# EAGLE design SubHarmonics Control Board v1 (EAGLE 9.6.2)
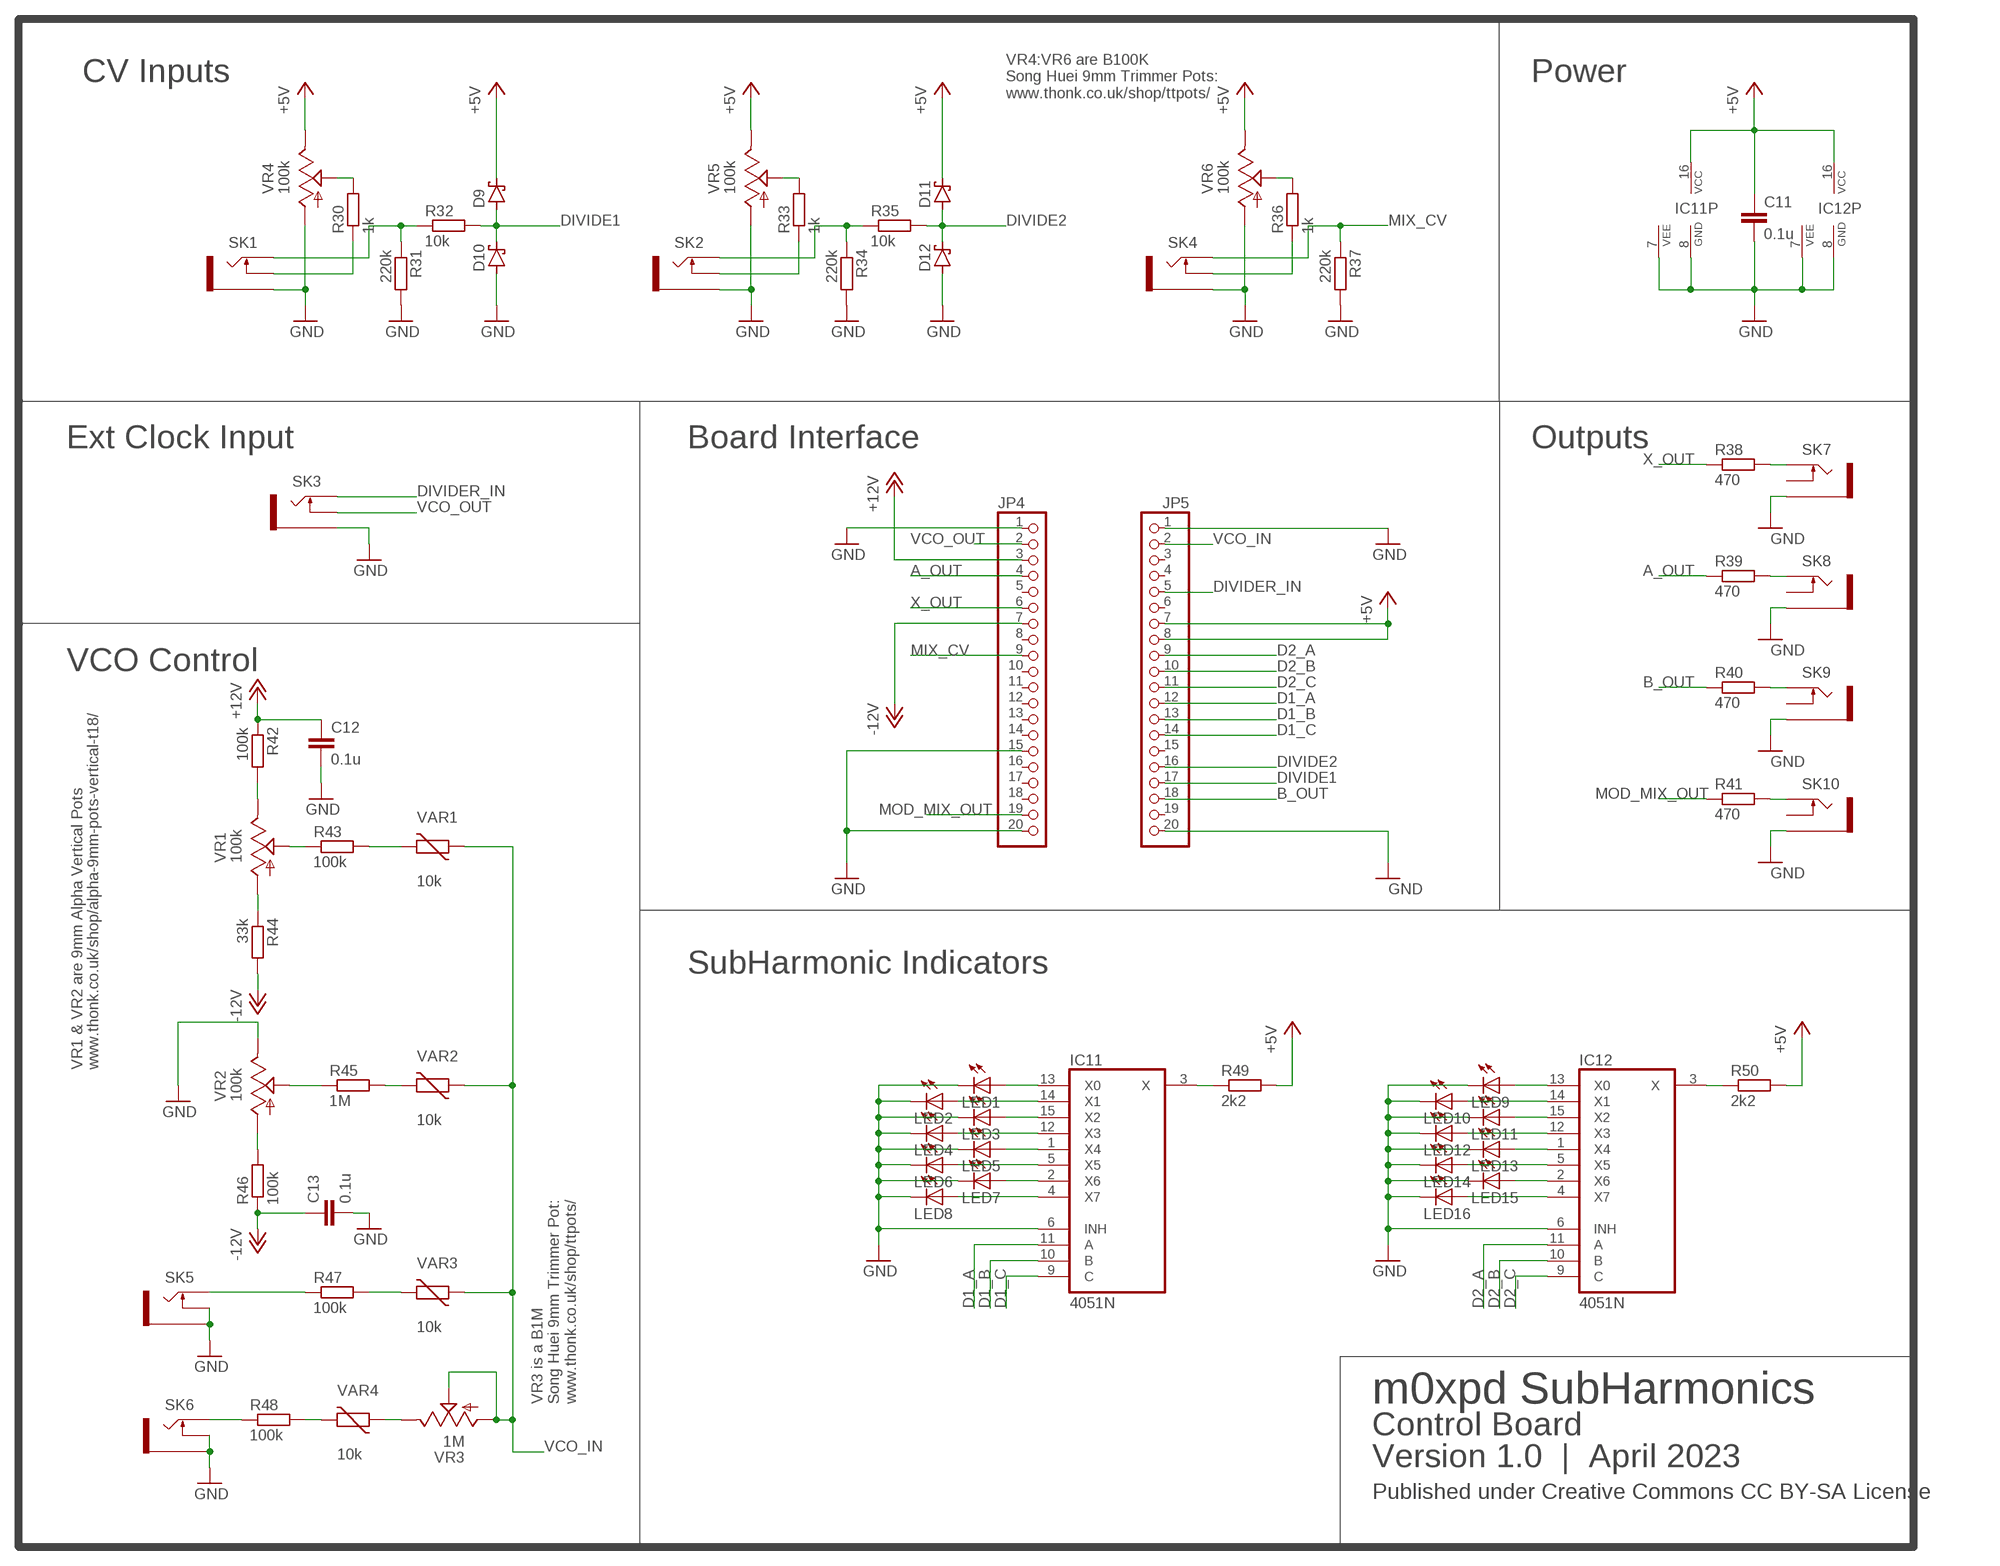
[diagram p0: schematic, sheet 1]

## Parts
C11  0.1u  C-EU050-025X075  [C050-025X075]
C12  0.1u  C-EU050-025X075  [C050-025X075]
C13  0.1u  C-EU050-025X075  [C050-025X075]
D9  1N5817-T  [DO41-7.6]
D10  1N5817-T  [DO41-7.6]
D11  1N5817-T  [DO41-7.6]
D12  1N5817-T  [DO41-7.6]
IC11  4051N  [DIL16]
IC12  4051N  [DIL16]
JP4  PINHD-1X20  [1X20]
JP5  PINHD-1X20  [1X20]
LED1  LED3MM  [LED3MM]
LED2  LED3MM  [LED3MM]
LED3  LED3MM  [LED3MM]
LED4  LED3MM  [LED3MM]
LED5  LED3MM  [LED3MM]
LED6  LED3MM  [LED3MM]
LED7  LED3MM  [LED3MM]
LED8  LED3MM  [LED3MM]
LED9  LED3MM  [LED3MM]
LED10  LED3MM  [LED3MM]
LED11  LED3MM  [LED3MM]
LED12  LED3MM  [LED3MM]
LED13  LED3MM  [LED3MM]
LED14  LED3MM  [LED3MM]
LED15  LED3MM  [LED3MM]
LED16  LED3MM  [LED3MM]
R30  1k  R-EU_0204/7  [0204/7]
R31  220k  R-EU_0204/7  [0204/7]
R32  10k  R-EU_0204/7  [0204/7]
R33  1k  R-EU_0204/7  [0204/7]
R34  220k  R-EU_0204/7  [0204/7]
R35  10k  R-EU_0204/7  [0204/7]
R36  1k  R-EU_0204/7  [0204/7]
R37  220k  R-EU_0204/7  [0204/7]
R38  470  R-EU_0204/7  [0204/7]
R39  470  R-EU_0204/7  [0204/7]
R40  470  R-EU_0204/7  [0204/7]
R41  470  R-EU_0204/7  [0204/7]
R42  100k  R-EU_0204/7  [0204/7]
R43  100k  R-EU_0204/7  [0204/7]
R44  33k  R-EU_0204/7  [0204/7]
R45  1M  R-EU_0204/7  [0204/7]
R46  100k  R-EU_0204/7  [0204/7]
R47  100k  R-EU_0204/7  [0204/7]
R48  100k  R-EU_0204/7  [0204/7]
R49  2k2  R-EU_0204/7  [0204/7]
R50  2k2  R-EU_0204/7  [0204/7]
SK1  THONKICONN_JACK  [WQP-PJ301M-12_JACK]
SK2  THONKICONN_JACK  [WQP-PJ301M-12_JACK]
SK3  THONKICONN_JACK  [WQP-PJ301M-12_JACK]
SK4  THONKICONN_JACK  [WQP-PJ301M-12_JACK]
SK5  THONKICONN_JACK  [WQP-PJ301M-12_JACK]
SK6  THONKICONN_JACK  [WQP-PJ301M-12_JACK]
SK7  THONKICONN_JACK  [WQP-PJ301M-12_JACK]
SK8  THONKICONN_JACK  [WQP-PJ301M-12_JACK]
SK9  THONKICONN_JACK  [WQP-PJ301M-12_JACK]
SK10  THONKICONN_JACK  [WQP-PJ301M-12_JACK]
VAR1  10k  VARISTOR  [C025-024X044]
VAR2  10k  VARISTOR  [C025-024X044]
VAR3  10k  VARISTOR  [C025-024X044]
VAR4  10k  VARISTOR  [C025-024X044]
VR1  100k  9MM_SNAP-IN_POT_  [9MM_SNAP-IN_POT]
VR2  100k  9MM_SNAP-IN_POT_  [9MM_SNAP-IN_POT]
VR3  1M  9MM_SNAP-IN_POT_  [9MM_SNAP-IN_POT]
VR4  100k  9MM_SNAP-IN_POT_  [9MM_SNAP-IN_POT]
VR5  100k  9MM_SNAP-IN_POT_  [9MM_SNAP-IN_POT]
VR6  100k  9MM_SNAP-IN_POT_  [9MM_SNAP-IN_POT]

## Nets
+5V: C11.1 D9.C D11.C IC11.16(VCC) IC12.16(VCC) JP5.7 JP5.8 R49.2 R50.2 VR4.3(E) VR5.3(E) VR6.3(E)
+12V: C12.1 JP4.3 R42.1
-12V: C13.1 JP4.7 R44.2 R46.1
A_OUT: JP4.4 R39.1
B_OUT: JP5.18 R40.1
D1_A: IC11.11(A) JP5.12
D1_B: IC11.10(B) JP5.13
D1_C: IC11.9(C) JP5.14
D2_A: IC12.11(A) JP5.9
D2_B: IC12.10(B) JP5.10
D2_C: IC12.9(C) JP5.11
DIVIDE1: D9.A D10.C JP5.17 R32.2
DIVIDE2: D11.A D12.C JP5.16 R35.2
DIVIDER_IN: JP5.5 SK3.P$1_TIP(TIP)
GND: C11.2 C12.2 C13.2 D10.A D12.A IC11.6(INH) IC11.7(VEE) IC11.8(GND) IC12.6(INH) IC12.7(VEE) IC12.8(GND) JP4.1 JP4.15 JP4.20 JP5.1 JP5.20 LED1.K(C) LED2.K(C) LED3.K(C) LED4.K(C) LED5.K(C) LED6.K(C) LED7.K(C) LED8.K(C) LED9.K(C) LED10.K(C) LED11.K(C) LED12.K(C) LED13.K(C) LED14.K(C) LED15.K(C) LED16.K(C) R31.2 R34.2 R37.2 SK1.P$3_SLEEVE(SLEEVE) SK2.P$3_SLEEVE(SLEEVE) SK3.P$3_SLEEVE(SLEEVE) SK4.P$3_SLEEVE(SLEEVE) SK5.P$2_SWITCH(SWITCH) SK5.P$3_SLEEVE(SLEEVE) SK6.P$2_SWITCH(SWITCH) SK6.P$3_SLEEVE(SLEEVE) SK7.P$3_SLEEVE(SLEEVE) SK8.P$3_SLEEVE(SLEEVE) SK9.P$3_SLEEVE(SLEEVE) SK10.P$3_SLEEVE(SLEEVE) VR2.3(E) VR4.1(A) VR5.1(A) VR6.1(A)
MIX_CV: JP4.9 R37.1 SK4.P$1_TIP(TIP)
MOD_MIX_OUT: JP4.19 R41.1
N$2: R38.2 SK7.P$1_TIP(TIP)
N$4: R39.2 SK8.P$1_TIP(TIP)
N$6: R40.2 SK9.P$1_TIP(TIP)
N$8: R41.2 SK10.P$1_TIP(TIP)
N$30: R30.1 SK1.P$2_SWITCH(SWITCH)
N$33: R31.1 R32.1 SK1.P$1_TIP(TIP)
N$34: R42.2 VR1.3(E)
N$35: R44.1 VR1.1(A)
N$36: R43.1 VR1.2(S)
N$38: R43.2 VAR1.2
N$39: R47.2 VAR3.2
N$40: R47.1 SK5.P$1_TIP(TIP)
N$41: R46.2 VR2.1(A)
N$42: R45.1 VR2.2(S)
N$43: R45.2 VAR2.2
N$44: R48.1 SK6.P$1_TIP(TIP)
N$45: R48.2 VAR4.2
N$46: VAR4.1 VR3.3(E)
N$56: R30.2 VR4.2(S)
N$57: R33.1 SK2.P$2_SWITCH(SWITCH)
N$58: R34.1 R35.1 SK2.P$1_TIP(TIP)
N$59: IC11.13(X0) LED1.A
N$60: IC11.14(X1) LED2.A
N$61: IC11.15(X2) LED3.A
N$62: IC11.12(X3) LED4.A
N$63: IC11.1(X4) LED5.A
N$64: IC11.5(X5) LED6.A
N$65: IC11.2(X6) LED7.A
N$66: IC11.4(X7) LED8.A
N$67: IC12.13(X0) LED9.A
N$71: IC11.3(X) R49.1
N$72: IC12.14(X1) LED10.A
N$73: IC12.15(X2) LED11.A
N$74: IC12.12(X3) LED12.A
N$75: IC12.1(X4) LED13.A
N$76: IC12.5(X5) LED14.A
N$77: IC12.2(X6) LED15.A
N$78: IC12.4(X7) LED16.A
N$81: R33.2 VR5.2(S)
N$82: IC12.3(X) R50.1
N$92: R36.1 SK4.P$2_SWITCH(SWITCH)
N$94: R36.2 VR6.2(S)
VCO_IN: JP5.2 VAR1.1 VAR2.1 VAR3.1 VR3.1(A) VR3.2(S)
VCO_OUT: JP4.2 SK3.P$2_SWITCH(SWITCH)
X_OUT: JP4.6 R38.1
Unconnected: JP4.5 JP4.8 JP4.10 JP4.11 JP4.12 JP4.13 JP4.14 JP4.16 JP4.17 JP4.18 JP5.3 JP5.4 JP5.6 JP5.15 JP5.19 SK7.P$2_SWITCH(SWITCH) SK8.P$2_SWITCH(SWITCH) SK9.P$2_SWITCH(SWITCH) SK10.P$2_SWITCH(SWITCH)

## Notes on the sheet
- CV Inputs | Power
- VR4:VR6 are B100K 
  Song Huei 9mm Trimmer Pots:
  www.thonk.co.uk/shop/ttpots/
- Ext Clock Input | Board Interface | Outputs
- VCO Control
- SubHarmonic Indicators
- VR1 & VR2 are 9mm Alpha Vertical Pots | www.thonk.co.uk/shop/alpha-9mm-pots-vertical-t18/
- VR3 is a B1M 
  Song Huei 9mm Trimmer Pot:
  www.thonk.co.uk/shop/ttpots/
- m0xpd SubHarmonics
- Control Board
- Version 1.0  |  April 2023
- Published under Creative Commons CC BY-SA License

## Library data of the parts
C11-C13 = rcl:C-EU: CAPACITOR, European symbol; SPICEPREFIX: C
D9-D12 = diode:1N581*: 1.0A SCHOTTKY BARRIER RECTIFIER Source: http://www.diodes.com/datasheets/ds23001.pdf
IC11 IC12 = 40xx:4051: 8-channel ANALOG MULTIPLEXER
JP4 JP5 = pinhead:PINHD-1X20: PIN HEADER
LED1-LED16 = adafruit:LED: LED OSRAM: - CHIPLED LG R971, LG N971, LY N971, LG Q971, LY Q971, LO R971, LY R971 LH N974, LH R974 LS Q976, LO Q976, LY Q976 LO Q996 - Hyper CHIPLED LW Q18S LB Q993, LB Q99A, LB R99A - SideLED LS A670, LO A670, LY A670, LG A670, LP A670 LB A673, LV A673, LT A673, LW A673 LH A674 LY A675 LS A676, LA A676, LO A676, LY A676, LW A676 LS A679, LY A679, LG A679 - Hyper Micro SIDELED® LS Y876, LA Y876, LO Y876, LY Y876 LT Y87S - SmartLED LW L88C, LW L88S LB L89C, LB L89S, LG L890 LS L89K, LO L89K, LY L89K LS L896, LA L896, LO L896, LY L896 - TOPLED LS T670, LO T670, LY T670, LG T670, LP T670 LSG T670, LSP T670, LSY T670, LOP T670, LYG T670 LG T671, LOG T671, LSG T671 LB T673, LV T673, LT T673, LW T673 LH T674 LS T676, LA T676, LO T676, LY T676, LB T676, LH T676, LSB T676, LW T676 LB T67C, LV T67C, LT T67C, LS T67K, LO T67K, LY T67K, LW E67C LS E67B, LA E67B, LO E67B, LY E67B, LB E67C, LV E67C, LT E67C LW T67C LS T679, LY T679, LG T679 LS T770, LO T770, LY T770, LG T770, LP T770 LB T773, LV T773, LT T773, LW T773 LH T774 LS E675, LA E675, LY E675, LS T675 LS T776, LA T776, LO T776, LY T776, LB T776 LHGB T686 LT T68C, LB T68C - Hyper Mini TOPLED® LB M676 - Mini TOPLED Santana® LG M470 LS M47K, LO M47K, LY M47K Source: http://www.osram.convergy.de/
R30-R50 = rcl:R-EU_: RESISTOR, European symbol; SPICEPREFIX: R
SK1-SK10 = MyLibrary:THONKICONN_JACK
VAR1-VAR4 = MyLibrary:VARISTOR: NTC Varistor
VR1-VR6 = MusicThingModular:9MM_SNAP-IN_POT: 9mm vertical snap-in pot, Alpha / Panasonic style

## Board
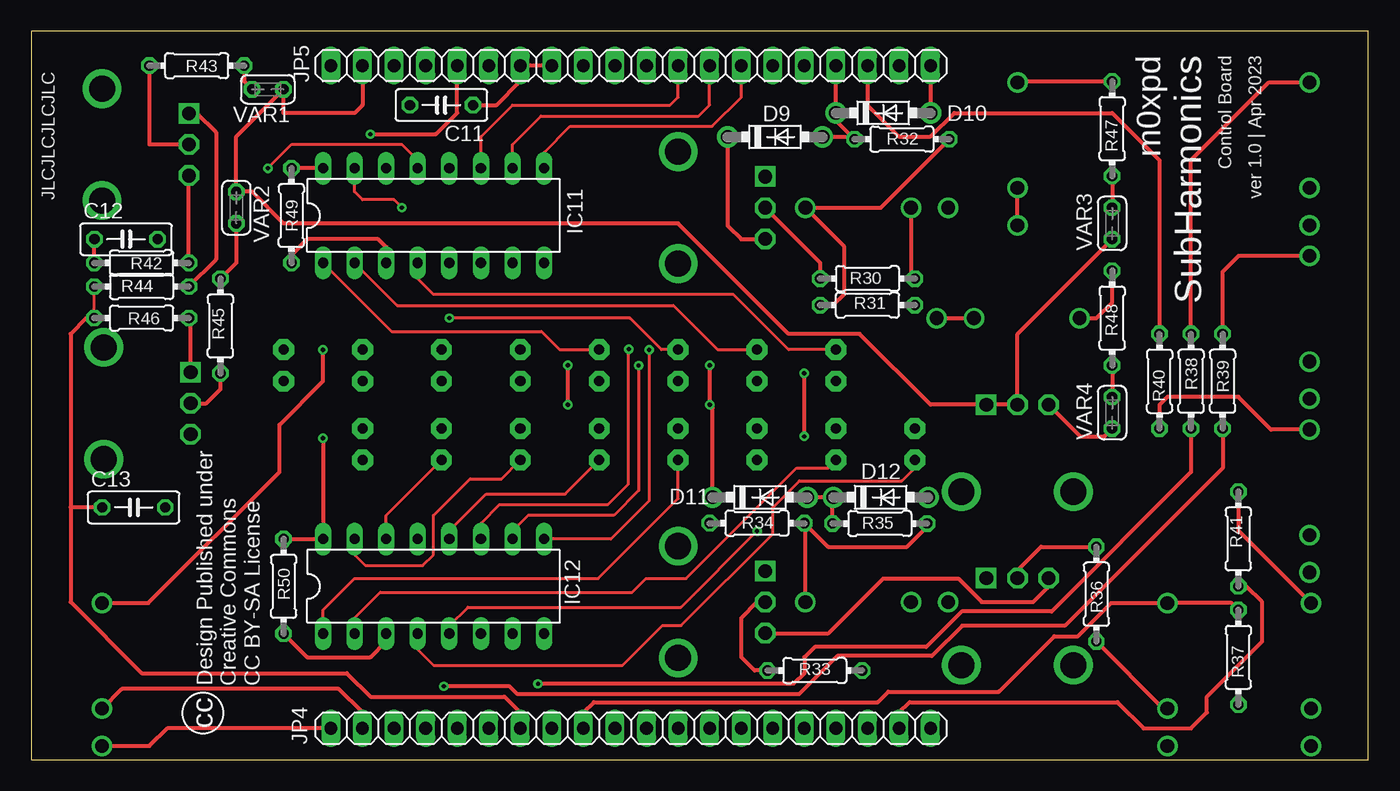
[diagram p1: board, top side]
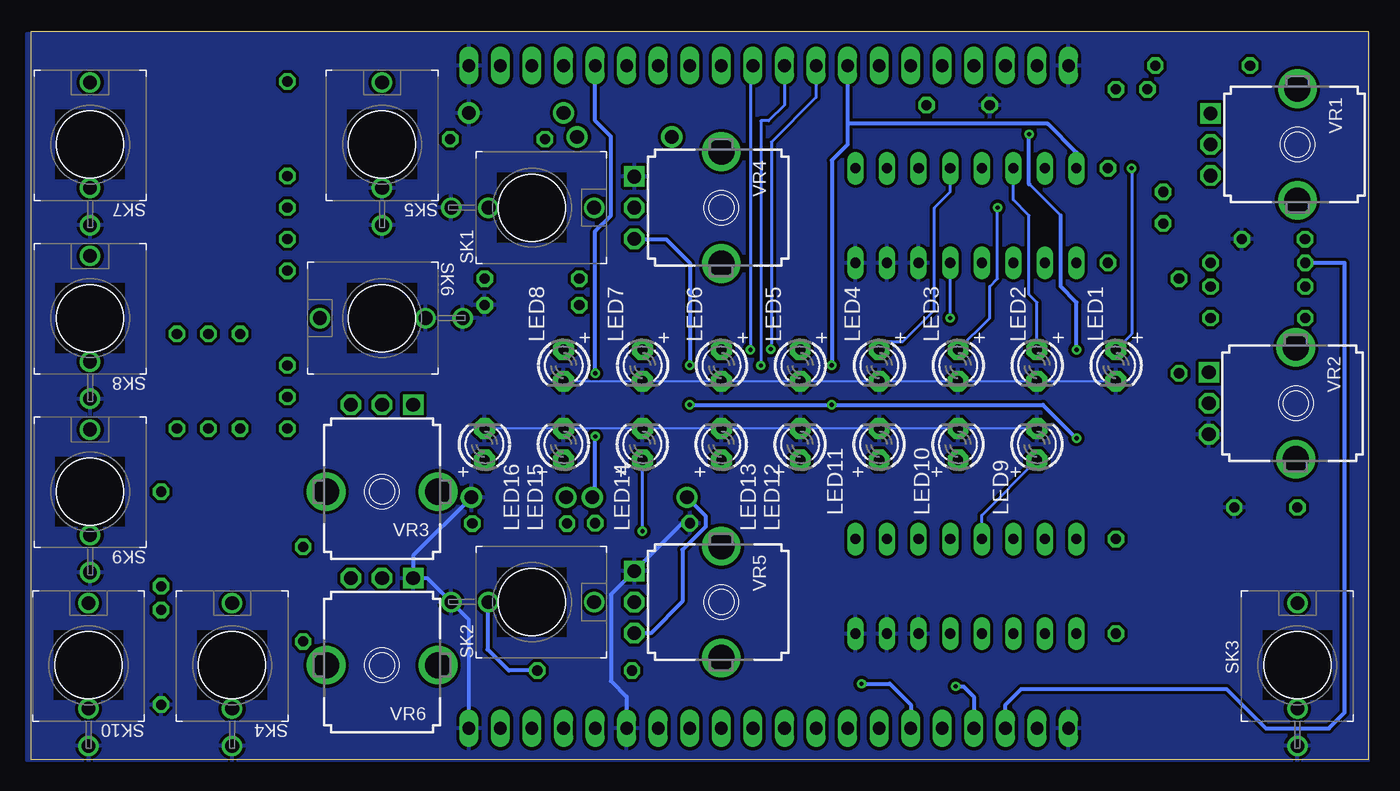
[diagram p2: board, bottom side, seen from below]

Size 107.62 x 58.66 mm. Coordinates in mm from the lower left corner, seen from the top.
Outline: 0,0 107.62,0 107.62,58.66 0,58.66 0,0
Copper layers (1*16): Top 0.035mm / dielectric 1.5mm / Bottom 0.035mm
Design rules "default *": minimum track width 6mil, minimum drill 0.35mm, track to track 10mil, track to pad 10mil, pad to pad 6mil, via to via 6mil, smd to smd 6mil, copper to edge 0mil, drill to drill 6mil, minimum pad ring 10mil, minimum via ring 8mil, stop-mask expansion 4mil, vias tented up to drill 0mil, thermal gap 10mil

### Footprints (pad centres in the part's own frame; a part is rotated, then mirrored left to right if it is on the bottom)
C050-025X075 = drill 0.813 octagon: 1 -2.54,0; 2 2.54,0
DO41-7.6 = drill 1.1 pad 1.7: A 3.81,0; C -3.81,0
DIL16 = drill 0.813 long: 1 -8.89,-3.81; 2 -6.35,-3.81; 3 -3.81,-3.81; 4 -1.27,-3.81; 5 1.27,-3.81; 6 3.81,-3.81; 7 6.35,-3.81; 8 8.89,-3.81; 9 8.89,3.81; 10 6.35,3.81; 11 3.81,3.81; 12 1.27,3.81; 13 -1.27,3.81; 14 -3.81,3.81; 15 -6.35,3.81; 16 -8.89,3.81
1X20 = drill 1.016 long: 1 -24.13,0; 2 -21.59,0; 3 -19.05,0; 4 -16.51,0; 5 -13.97,0; 6 -11.43,0; 7 -8.89,0; 8 -6.35,0; 9 -3.81,0; 10 -1.27,0; 11 1.27,0; 12 3.81,0; 13 6.35,0; 14 8.89,0; 15 11.43,0; 16 13.97,0; 17 16.51,0; 18 19.05,0; 19 21.59,0; 20 24.13,0
LED3MM = drill 0.813 pad 1.676 octagon: A -1.27,0; K 1.27,0
0204/7 = drill 0.813 octagon: 1 -3.81,0; 2 3.81,0
WQP-PJ301M-12_JACK = drill 1.1: P$1_TIP 0,5; P$2_SWITCH 0,-3.5; P$3_SLEEVE 0,-6.5
C025-024X044 = drill 0.813 octagon: 1 -1.27,0; 2 1.27,0
9MM_SNAP-IN_POT = drill 1.1 square: 1 -2.5,-7 | drill 1.1 octagon: 2 0,-7; 3 2.5,-7 | drill 2.1 pad 2.794: CHASSIS1 -4.5,0; CHASSIS2 4.5,0

### Placement (x,y rotation side)
C11  33.02,52.7 180 top
C12  7.65,41.91 0 top
C13  8.26,20.32 0 top
D9  59.87,50.14 0 top
D10  68.58,52.07 0 top
D11  58.65,21.13 0 top
D12  68.38,21.13 0 top
IC11  32.38,43.81 0 top
IC12  32.38,13.97 0 top
JP4  48.26,2.54 0 top
JP5  48.26,55.88 0 top
LED1  20.32,31.75 270 bottom
LED2  26.67,31.75 270 bottom
LED3  33.02,31.75 270 bottom
LED4  39.37,31.75 270 bottom
LED5  45.72,31.75 270 bottom
LED6  52.07,31.75 270 bottom
LED7  58.42,31.75 270 bottom
LED8  64.77,31.75 270 bottom
LED9  26.67,25.4 90 bottom
LED10  33.02,25.4 90 bottom
LED11  39.37,25.4 90 bottom
LED12  45.72,25.4 90 bottom
LED13  52.07,25.4 90 bottom
LED14  58.42,25.4 90 bottom
LED15  64.77,25.4 90 bottom
LED16  71.12,25.4 90 bottom
R30  67.31,38.73 180 top
R31  67.31,36.6 0 top
R32  70.08,49.96 180 top
R33  63.07,7.19 180 top
R34  58.42,19.05 180 top
R35  68.3,19.02 180 top
R36  85.72,13.34 90 top
R37  97.16,8.26 270 top
R38  93.34,30.48 90 top
R39  95.89,30.48 90 top
R40  90.81,30.48 270 top
R41  97.16,17.78 90 top
R42  8.89,40.01 0 top
R43  13.34,55.88 0 top
R44  8.89,38.1 180 top
R45  15.24,34.92 90 top
R46  8.89,35.56 0 top
R47  87,50.8 270 top
R48  87,35.56 270 top
R49  20.95,43.81 90 top
R50  20.32,13.97 90 top
SK1  67.31,44.45 270 bottom
SK2  67.31,12.7 270 bottom
SK3  5.71,7.62 0 bottom
SK4  91.44,7.62 0 bottom
SK5  79.38,49.53 0 bottom
SK6  79.38,35.56 90 bottom
SK7  102.87,49.53 0 bottom
SK8  102.87,35.56 0 bottom
SK9  102.87,21.59 0 bottom
SK10  103,7.62 0 bottom
VAR1  19.05,53.98 180 top
VAR2  16.51,44.45 270 top
VAR3  87,43.18 90 top
VAR4  87,27.94 90 top
VR1  5.71,49.53 270 bottom
VR2  5.84,28.7 270 bottom
VR3  79.38,21.59 180 bottom
VR4  52.07,44.45 270 bottom
VR5  52.07,12.7 270 bottom
VR6  79.38,7.62 180 bottom

### Tracks (layer width: path | path; a pad name or v marks a point on that pad's centre or on a via)
+5V  (via drill 0.35)
  Top 0.305: v43.18,31.75 v43.18,28.57 | v23.5,25.88 IC12.16 R50.2 | IC11.16 R49.2 | JP5.8 JP5.7 39.37,54.61 37.47,52.7 C11.1 | VR5.3 64.17,10.2 68.58,14.61 74.61,14.61 76.51,12.7 80.64,12.7 81.88,13.93 VR6.3 | D11.C 54.84,28.35 v54.61,28.57 v54.61,31.75 | D9.C 56.06,43 57.15,41.91 59.03,41.91 VR4.3
  Bottom 0.305: v43.18,31.75 43.18,48.26 41.91,49.53 41.91,51.21 | JP5.8 41.91,51.21 | v23.5,25.88 26.19,28.57 v43.18,28.57 v54.61,28.57 | IC11.16 23.5,48.9 25.81,51.21 41.91,51.21 | D11.C 53.34,19.63 53.34,18.77 55.2,16.91 55.2,12.74 57.74,10.2 VR5.3 | VR4.3 59.03,41.91 56.52,41.91 54.61,40.01 v54.61,31.75
+12V
  Top 0.152: 5.08,41.88 C12.1
  Top 0.305: R42.1 5.08,41.88
  Bottom 0.305: JP4.3 29.21,4.45 27.94,5.71 11.43,5.71 8.26,2.54 3.17,2.54 1.91,3.81 1.91,40.01 R42.1
-12V
  Top 0.254: R46.1 R44.2
  Top 0.305: R46.1 4.45,35.56 3.17,34.29 3.17,20.32 | 3.17,20.32 3.17,12.7 8.89,6.99 25.4,6.99 27.3,5.08 38.1,5.08 39.37,3.81 JP4.7 | C13.1 3.17,20.32
A_OUT  (via drill 0.35)
  Top 0.305: R39.1 95.89,23.5 83.19,10.79 74.93,10.79 72.49,8.36 64.87,8.36 61.8,5.28 39.15,5.28 38.52,5.92 v33.22,5.92
  Bottom 0.305: v33.22,5.92 32.59,5.92 31.75,5.08 JP4.4
B_OUT
  Top 0.305: R40.1 90.81,48.26 87,52.07 74.3,52.07 72.39,50.16 69.85,50.16 67.31,52.7 JP5.18
D1_A
  Top 0.254: IC11.11 36.2,50.16 38.73,52.7 51.44,52.7 52.07,53.34 JP5.12
D1_B
  Top 0.254: IC11.10 38.73,49.53 41.02,51.82 53.72,51.82 54.61,52.7 JP5.13
D1_C
  Top 0.254: IC11.9 41.27,48.9 43.38,51 54.81,51 57.15,53.34 JP5.14
D2_A  (via drill 0.35)
  Top 0.152: v48.09,33.06 48.09,32.81 48.06,32.79
  Top 0.254: 48.06,32.79 48.06,22.17 46.41,20.52 37.67,20.52 36.2,19.05 IC12.11
  Bottom 0.152: v48.09,33.06 48.09,33.42 48.06,33.45
  Bottom 0.254: JP5.9 44.45,53.34 48.06,49.73 48.06,33.45
D2_B  (via drill 0.35)
  Top 0.152: 48.89,25.41 48.9,25.4 | 48.9,24.98 48.89,24.98
  Top 0.254: v48.89,31.74 48.89,25.41 | 48.9,25.4 48.9,24.98 | 48.89,24.98 48.89,21.67 46.9,19.68 40.01,19.68 38.73,18.41 IC12.10
  Bottom 0.152: v48.9,31.75 v48.89,31.74
  Bottom 0.254: JP5.10 46.99,52.7 48.26,51.44 48.9,51.44 v48.9,31.75
D2_C  (via drill 0.35)
  Top 0.254: v49.73,33.02 49.73,20.85 46.66,17.78 IC12.9
  Bottom 0.152: JP5.11 49.73,55.68
  Bottom 0.254: 49.73,55.68 v49.73,33.02
DIVIDE1
  Top 0.305: D9.A 66.09,50.14 R32.2 64.77,51.46 D10.C JP5.17
DIVIDE2  (via drill 0.35)
  Top 0.305: R35.2 64.49,21.06 D12.C D11.A | v62.23,26.04 v62.23,31.11
  Bottom 0.305: D11.A 62.23,21.36 v62.23,26.04 | v62.23,31.11 62.23,42.55 60.96,43.81 60.96,50.16 62.23,51.44 JP5.16
DIVIDER_IN  (via drill 0.35)
  Top 0.305: v23.5,33.02 23.5,30.48 19.99,26.98 19.99,23.16 9.45,12.62 SK3.P$1_TIP | v27.3,50.37 32.59,50.37 34.29,52.07 JP5.5
  Bottom 0.254: 24.77,43.81 27.28,46.33
  Bottom 0.305: v23.5,33.02 23.5,36.83 24.77,38.1 24.77,43.81 | 27.28,46.33 27.3,46.33 v27.3,50.37
GND
  Top 0.305: SK5.P$3_SLEEVE SK5.P$2_SWITCH | SK6.P$3_SLEEVE SK6.P$2_SWITCH | JP4.1 10.95,2.54 9.53,1.12 SK3.P$3_SLEEVE | JP5.20 D10.A
  Bottom 0.152: LED8.K LED7.K LED6.K LED5.K LED4.K LED3.K LED2.K LED1.K | LED9.K LED10.K LED11.K LED12.K | 46.35,26.67 LED12.K | LED12.K LED13.K LED14.K LED15.K LED16.K
  Bottom 0.305: R34.2 55.22,19.05 VR5.1 60.96,13.31 60.96,6.35 59.69,5.08 JP4.15 | JP4.20 72.39,11.28 SK2.P$3_SLEEVE 75.73,14.62 VR6.1 76.88,16.45 D12.A
  pour Bottom: 0,0 0,58.42 107.95,58.42 107.95,0
MIX_CV
  Top 0.305: R37.1 96.6,12.62 SK4.P$1_TIP 86.92,12.62 84.25,9.96 82.35,9.96 77.88,5.49 68.99,5.49 68.15,4.65 45.29,4.65 44.45,3.81 JP4.9
MOD_MIX_OUT
  Top 0.305: JP4.19 69.85,3.81 70.69,4.65 87.43,4.65 89.53,2.54 93.34,2.54 94.61,3.81 94.61,5.08 99.06,9.53 99.06,12.7 97.79,13.97 R41.1
N$2
  Top 0.305: R38.2 93.34,48.26 99.61,54.53 SK7.P$1_TIP
N$4
  Top 0.305: SK8.P$1_TIP 97.16,40.56 95.89,39.29 R39.2
N$6
  Top 0.305: SK9.P$1_TIP 99.78,26.59 97.16,29.21 91.44,29.21 90.81,28.57 R40.2
N$8
  Top 0.305: SK10.P$1_TIP 97.16,18.46 R41.2
N$30
  Top 0.305: SK1.P$2_SWITCH 70.81,39.05 R30.1
N$33
  Top 0.305: R31.1 64.54,36.6 65.41,37.47 65.41,41.35 SK1.P$1_TIP 68.38,44.45 R32.1
N$34
  Top 0.305: R42.2 12.7,47.02 VR1.3
N$35
  Top 0.305: R44.1 14.88,40.28 14.88,50.52 13.38,52.03 VR1.1
N$36
  Top 0.305: VR1.2 9.53,49.53 R43.1
N$38
  Top 0.305: R43.2 17.14,54.61 VAR1.2
N$39
  Top 0.305: R47.2 VAR3.2
N$40
  Top 0.305: SK5.P$1_TIP 79.45,54.61 R47.1
N$41
  Top 0.305: VR2.1 12.84,35.42 R46.2
N$42
  Top 0.305: VR2.2 14.1,28.7 15.24,29.84 R45.1
N$43
  Top 0.305: R45.2 16.51,40.01 VAR2.2
N$44
  Top 0.305: SK6.P$1_TIP 85.72,35.56 87,36.83 R48.1
N$45
  Top 0.305: R48.2 VAR4.2
N$46
  Top 0.305: VR3.3 84.43,26.04 86.36,26.04 VAR4.1
N$56
  Top 0.305: VR4.2 63.5,40.02 R30.2
N$57
  Bottom 0.305: R33.1 69.19,7.19 70.89,8.89 70.89,12.62 SK2.P$2_SWITCH
N$58
  Top 0.305: SK2.P$1_TIP 62.31,18.97 R34.1 64.14,17.14 70.48,17.14 72.11,18.77 R35.1
N$59  (via drill 0.35)
  Top 0.152: 31.09,47.65 IC11.13
  Top 0.254: 31.09,47.65 31.09,48.28 29.82,49.55 20.98,49.55 v19.05,47.62
  Bottom 0.254: LED1.A 19.05,34.29 v19.05,47.62
N$60
  Bottom 0.254: LED2.A 26.67,36.83 27.3,37.47 27.3,43.81 28.57,45.09 IC11.14
N$61  (via drill 0.35)
  Top 0.254: v29.84,44.45 29.21,45.09 26.67,45.09 26.04,45.72 IC11.15
  Bottom 0.254: LED3.A 30.48,35.56 30.48,38.1 29.84,38.73 v29.84,44.45
N$62
  Bottom 0.152: LED4.A 38.73,33.66
  Bottom 0.254: 38.73,33.66 37.47,33.66 34.92,36.2 34.92,44.45 33.66,45.72 IC11.12
N$63
  Top 0.254: IC11.1 29.01,34.49 41.07,34.49 42.55,33.02 LED5.A
N$64  (via drill 0.35)
  Top 0.254: LED6.A 50.72,33.02 48.18,35.56 v33.66,35.56
  Bottom 0.254: v33.66,35.56 IC11.5
N$65
  Top 0.254: IC11.2 29.46,36.58 51.69,36.58 55.24,33.02 LED7.A
N$66
  Top 0.254: IC11.4 31.11,38.73 32.38,37.47 56.52,37.47 60.96,33.02 LED8.A
N$67
  Bottom 0.254: IC12.13 31.11,19.68 LED9.A
N$71
  Top 0.305: IC11.3 28.57,41.27 27.94,41.91 22.23,41.91 20.95,40.64 R49.1
N$72
  Top 0.254: IC12.14 28.57,19.68 LED10.A
N$73
  Top 0.254: IC12.15 26.04,16.51 26.9,15.65 31.52,15.65 32.38,16.51 32.38,19.68 35.33,22.63 37.87,22.63 LED11.A
N$74
  Top 0.254: IC12.12 33.66,18.41 36.63,21.39 42.98,21.39 LED12.A
N$75
  Top 0.254: IC12.1 23.5,12.06 26.04,14.61 45.64,14.61 52.07,21.03 LED13.A
N$76  (via drill 0.35)
  Top 0.254: IC12.5 33.66,10.79 35.15,12.29 52.3,12.29 v58.42,18.41
  Bottom 0.254: v58.42,18.41 LED14.A
N$77
  Top 0.254: IC12.2 26.04,11.43 28.09,13.49 48.36,13.49 49.48,14.61 52.7,14.61 61.59,23.5 64.14,23.5 LED15.A
N$78
  Top 0.254: IC12.4 31.11,8.89 32.38,7.62 47.6,7.62 50.8,10.82 52.31,10.82 59.69,18.2 59.69,20.32 61.82,22.45 70.08,22.45 71.12,23.5 LED16.A
N$81
  Top 0.305: R33.2 58.22,7.19 57.15,8.26 57.15,11.43 58.42,12.7 VR5.2
N$82
  Top 0.305: R50.1 22.23,8.26 27.3,8.26 28.57,9.53 IC12.3
N$92
  Top 0.305: R36.1 91.13,4.12 SK4.P$2_SWITCH
N$94
  Top 0.305: VR6.2 79.38,15.24 81.28,17.14 R36.2
VCO_IN
  Top 0.305: JP5.2 26.67,52.7 26.04,52.07 20.32,52.07 VAR1.1 16.51,50.16 VAR2.1 17.78,45.72 20.32,43.18 52.07,43.18 60.96,34.29 66.67,34.29 72.38,28.59 VR3.1 VR3.2 79.38,34.29 VAR3.1
VCO_OUT
  Top 0.305: JP4.2 26.67,3.81 24.77,5.71 7.31,5.71 SK3.P$2_SWITCH
X_OUT  (via drill 0.35)
  Top 0.305: R38.1 93.34,23.16 82.13,11.95 74.89,11.95 72.04,9.09 63.07,9.09 62.23,8.26 62.23,6.99 61.37,6.12 v40.79,6.12
  Bottom 0.305: v40.79,6.12 38.51,6.12 36.83,4.45 JP4.6

### Text on the board
tPlace: Design Published under / Creative Commons / CC BY-SA License
tNames: m0xpd | SubHarmonics | Control Board | ver 1.0 | Apr 2023 | JLCJLCJLCJLC | cc